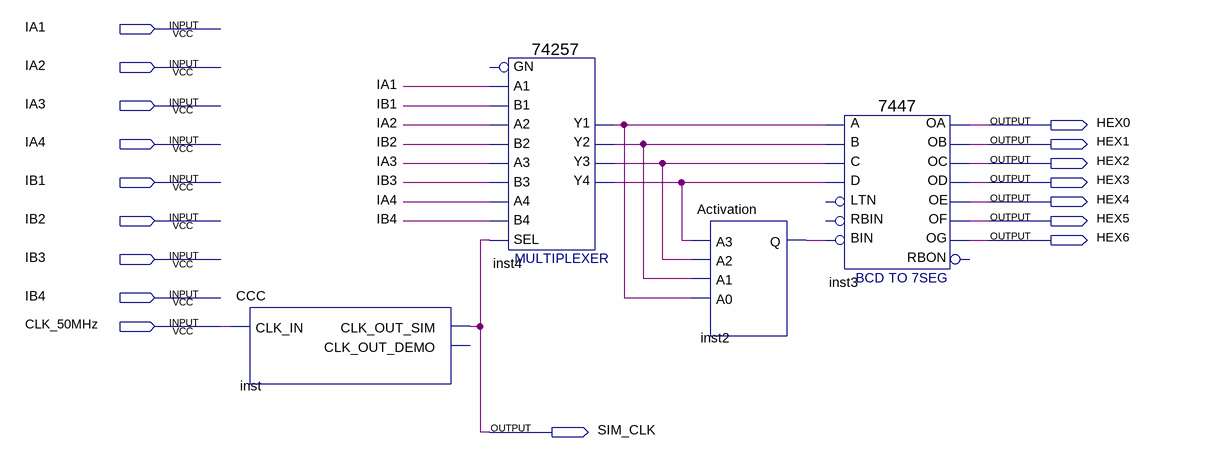
[diagram p0: schematic sheet]
// Quartus schematic Lab2.bdf as structural Verilog: 4 symbols, 17 pins
module Lab2 (
  input  IA1,
  input  IA2,
  input  IA3,
  input  IA4,
  input  IB1,
  input  IB2,
  input  IB3,
  input  IB4,
  input  CLK_50MHz,
  output HEX0,
  output HEX1,
  output HEX2,
  output HEX3,
  output HEX4,
  output HEX5,
  output HEX6,
  output SIM_CLK
);

  wire inst2_q, inst4_y1, inst4_y2, inst4_y3, inst4_y4;

  CCC inst (.CLK_IN(CLK_50MHz), .CLK_OUT_SIM(SIM_CLK));  // open: CLK_OUT_DEMO
  \74257  inst4 (
    .B1(IB1), .A1(IA1), .B3(IB3), .A2(IA2), .B2(IB2), .A3(IA3), .A4(IA4), .B4(IB4), .SEL(SIM_CLK),
    .Y2(inst4_y2), .Y3(inst4_y3), .Y4(inst4_y4), .Y1(inst4_y1));  // open: GN
  Activation inst2 (.A3(inst4_y4), .A2(inst4_y3), .A1(inst4_y2), .A0(inst4_y1), .Q(inst2_q));
  \7447  inst3 (
    .B(inst4_y2), .C(inst4_y3), .D(inst4_y4), .BIN(inst2_q), .A(inst4_y1), .OB(HEX1), .OC(HEX2), .OE(HEX4),
    .OD(HEX3), .OF(HEX5), .OG(HEX6), .OA(HEX0));  // open: LTN, RBIN, RBON
endmodule
